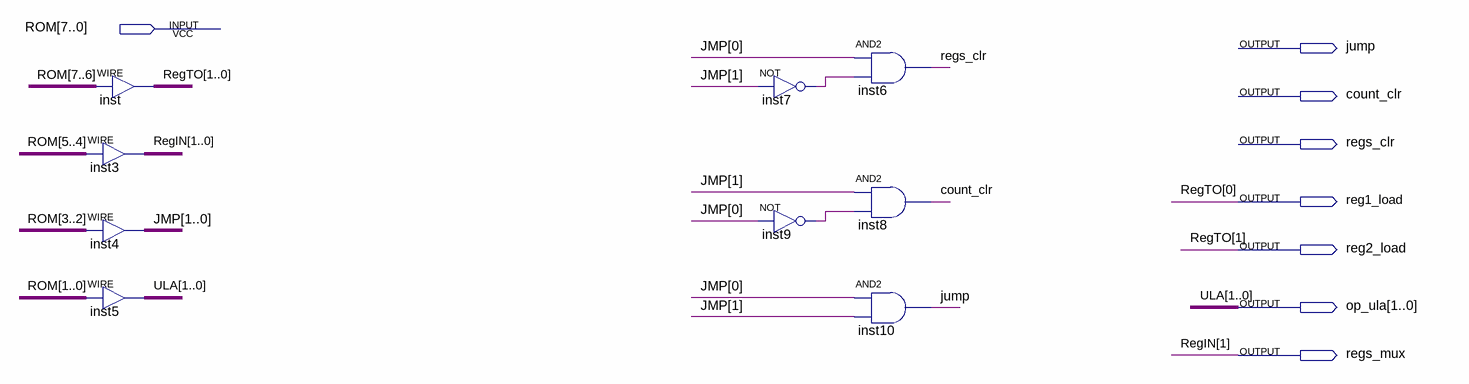
[diagram p0: schematic sheet]
// Quartus schematic UDC.bdf as structural Verilog: 9 symbols, 8 pins
module UDC (
  input  [7:0] ROM,
  output jump,
  output count_clr,
  output regs_clr,
  output reg1_load,
  output reg2_load,
  output [1:0] op_ula,
  output regs_mux
);

  wire inst7_out, inst9_out;
  wire [0:0] RegIN;
  wire [1:0] JMP;

  assign {regs_mux, RegIN[0]} = ROM[5:4];  // WIRE inst3
  assign JMP = ROM[3:2];  // WIRE inst4
  assign op_ula = ROM[1:0];  // WIRE inst5
  assign {reg2_load, reg1_load} = ROM[7:6];  // WIRE inst
  not inst7 (inst7_out, JMP[1]);
  not inst9 (inst9_out, JMP[0]);
  and inst6 (regs_clr, JMP[0], inst7_out);
  and inst8 (count_clr, JMP[1], inst9_out);
  and inst10 (jump, JMP[0], JMP[1]);

  // Other names for the same wires on the sheet: RegIN[1] = regs_mux; RegTO[1:0] = {reg2_load, reg1_load};
  //   ULA[1:0] = op_ula
endmodule
